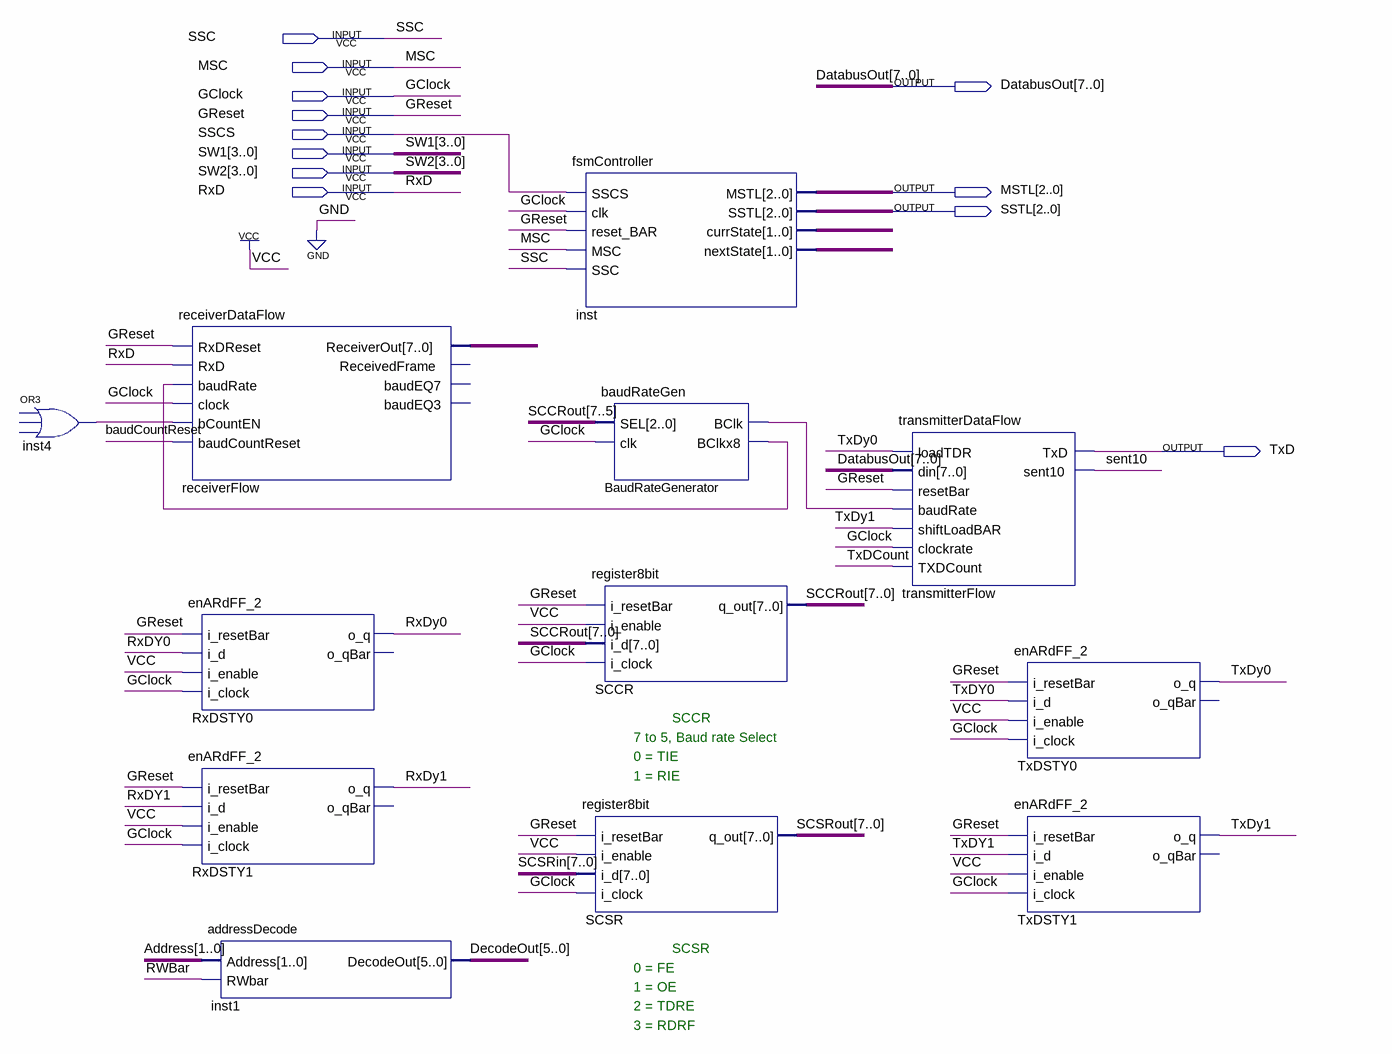
[diagram p0: schematic sheet]
// Quartus schematic Toplevel.bdf as structural Verilog: 12 symbols, 12 pins
module Toplevel (
  input  SSC,
  input  MSC,
  input  GClock,
  input  GReset,
  input  SSCS,
  input  [3:0] SW1,
  input  [3:0] SW2,
  input  RxD,
  output [7:0] DatabusOut,
  output [2:0] MSTL,
  output [2:0] SSTL,
  output TxD
);

  wire baudCountReset, BaudRateGenerator_bclk, BaudRateGenerator_bclkx8, inst4_out, RWBar, RxDy0, RxDy1,
       sent10, TxDCount, TxDy0, TxDy1;
  wire [1:0] Address, inst_currstate, inst_nextstate;
  wire [5:0] DecodeOut;
  wire [7:0] receiverFlow_receiverout, SCCRout, SCSRin, SCSRout;

  // OR3 inst4 has open pins: IN1=open, IN2=open, IN3=open, OUT=inst4_out
  receiverDataFlow receiverFlow (
    .RxDReset(GReset), .RxD(RxD), .baudRate(BaudRateGenerator_bclkx8), .clock(GClock), .bCountEN(inst4_out),
    .baudCountReset(baudCountReset), .ReceiverOut(receiverFlow_receiverout));  // open: ReceivedFrame, baudEQ7, baudEQ3
  enARdFF_2 RxDSTY0 (.i_resetBar(GReset), .i_d(RxDy0), .i_enable(1'b1), .i_clock(GClock), .o_q(RxDy0));  // open: o_qBar
  enARdFF_2 RxDSTY1 (.i_resetBar(GReset), .i_d(RxDy1), .i_enable(1'b1), .i_clock(GClock), .o_q(RxDy1));  // open: o_qBar
  addressDecode inst1 (.Address(Address), .RWbar(RWBar), .DecodeOut(DecodeOut));
  fsmController inst (
    .SSCS(SSCS), .clk(GClock), .reset_BAR(GReset), .MSC(MSC), .SSC(SSC), .MSTL(MSTL), .SSTL(SSTL),
    .currState(inst_currstate), .nextState(inst_nextstate));
  baudRateGen BaudRateGenerator (
    .SEL(SCCRout[7:5]), .clk(GClock), .BClk(BaudRateGenerator_bclk), .BClkx8(BaudRateGenerator_bclkx8));
  register8bit SCCR (.i_resetBar(GReset), .i_enable(1'b1), .i_d(SCCRout), .i_clock(GClock), .q_out(SCCRout));
  register8bit SCSR (.i_resetBar(GReset), .i_enable(1'b1), .i_d(SCSRin), .i_clock(GClock), .q_out(SCSRout));
  transmitterDataFlow transmitterFlow (
    .loadTDR(TxDy0), .din(DatabusOut), .resetBar(GReset), .baudRate(BaudRateGenerator_bclk),
    .shiftLoadBAR(TxDy1), .clockrate(GClock), .TXDCount(TxDCount), .TxD(TxD), .sent10(sent10));
  enARdFF_2 TxDSTY0 (.i_resetBar(GReset), .i_d(TxDy0), .i_enable(1'b1), .i_clock(GClock), .o_q(TxDy0));  // open: o_qBar
  enARdFF_2 TxDSTY1 (.i_resetBar(GReset), .i_d(TxDy1), .i_enable(1'b1), .i_clock(GClock), .o_q(TxDy1));  // open: o_qBar

  // Notes on the sheet:
  //   SCCR
  //   7 to 5, Baud rate Select
  //   0 = TIE
  //   1 = RIE
  //   SCSR
  //   0 = FE
  //   1 = OE
  //   2 = TDRE
  //   3 = RDRF
endmodule
